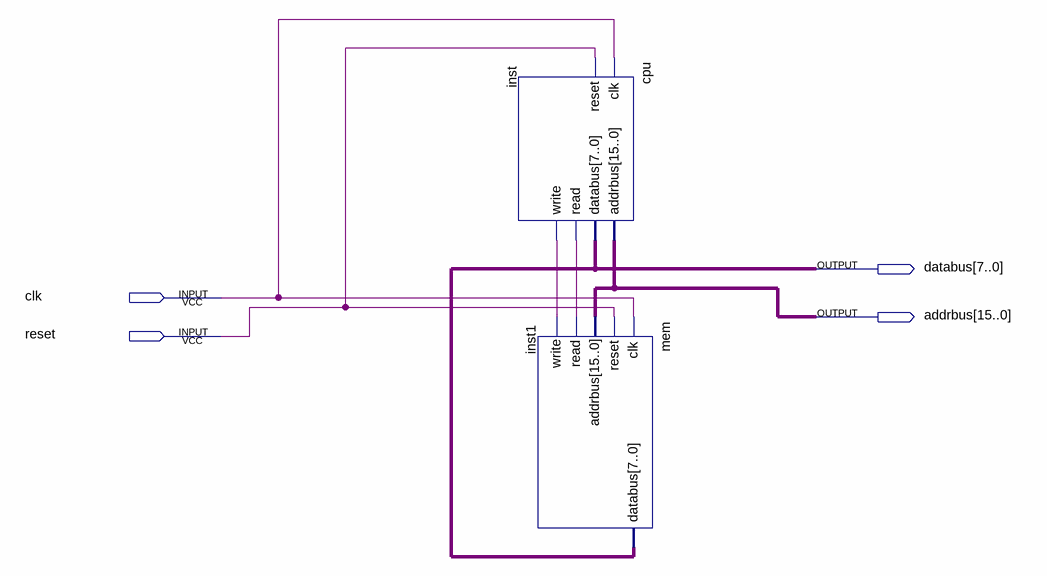
[diagram p0: schematic sheet]
// Quartus schematic rscomp.bdf as structural Verilog: 2 symbols, 4 pins
module rscomp (
  input  clk,
  input  reset,
  output [7:0] databus,
  output [15:0] addrbus
);

  wire inst_read, inst_write;

  cpu inst (.clk(clk), .reset(reset), .addrbus(addrbus), .read(inst_read), .write(inst_write), .databus(databus));
  mem inst1 (.clk(clk), .reset(reset), .addrbus(addrbus), .read(inst_read), .write(inst_write), .databus(databus));
endmodule
